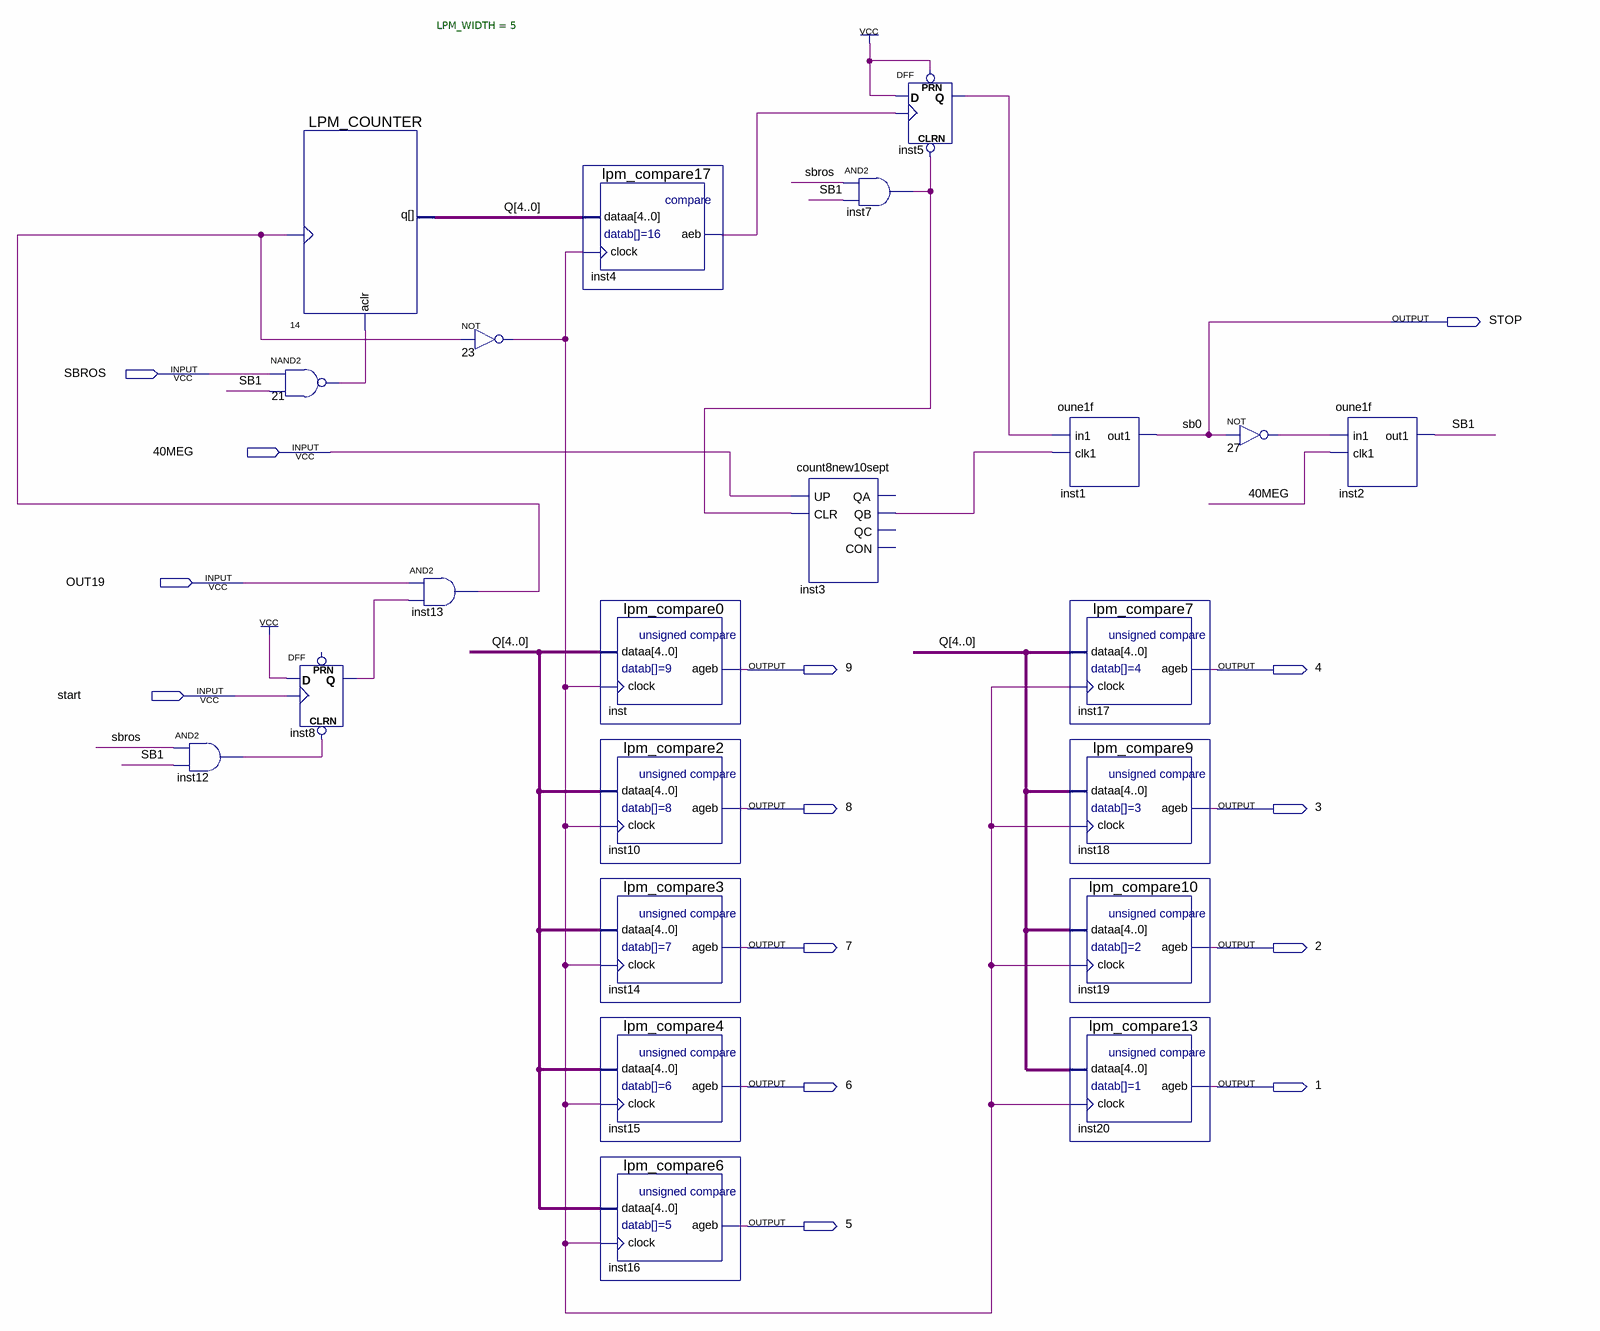
[diagram p0: schematic sheet]
// Quartus schematic count_N_6DES.bdf as structural Verilog: 22 symbols, 14 pins
module count_N_6DES (
  input  SBROS,
  input  \40MEG ,
  input  OUT19,
  input  start,
  output STOP,
  output \9 ,
  output \4 ,
  output \8 ,
  output \3 ,
  output \7 ,
  output \2 ,
  output \6 ,
  output \1 ,
  output \5 
);

  wire inst3_qb, inst4_aeb, inst5_q, inst7_out, inst8_q, inst12_out, inst13_out, n21_out, n23_out, n27_out,
       SB1;
  wire [4:0] Q;

  and inst12 (inst12_out, SBROS, SB1);
  LPM_COUNTER #(.LPM_WIDTH(5)) u_14 (.clock(inst13_out), .aclr(n21_out), .q(Q));
  nand u_21 (n21_out, SBROS, SB1);
  DFF inst8 (.CLRN(inst12_out), .CLK(start), .D(1'b1), .Q(inst8_q));  // open: PRN
  and inst13 (inst13_out, OUT19, inst8_q);
  not u_23 (n23_out, inst13_out);
  lpm_compare17 inst4 (.dataa(Q), .clock(n23_out), .aeb(inst4_aeb));
  lpm_compare0 inst (.dataa(Q), .clock(n23_out), .ageb(\9 ));
  lpm_compare2 inst10 (.dataa(Q), .clock(n23_out), .ageb(\8 ));
  lpm_compare3 inst14 (.dataa(Q), .clock(n23_out), .ageb(\7 ));
  lpm_compare4 inst15 (.dataa(Q), .clock(n23_out), .ageb(\6 ));
  lpm_compare6 inst16 (.dataa(Q), .clock(n23_out), .ageb(\5 ));
  count8new10sept inst3 (.UP(\40MEG ), .CLR(inst7_out), .QB(inst3_qb));  // open: QA, QC, CON
  and inst7 (inst7_out, SBROS, SB1);
  DFF inst5 (.CLRN(inst7_out), .CLK(inst4_aeb), .D(1'b1), .PRN(1'b1), .Q(inst5_q));
  oune1f inst1 (.in1(inst5_q), .clk1(inst3_qb), .out1(STOP));
  lpm_compare7 inst17 (.dataa(Q), .clock(n23_out), .ageb(\4 ));
  lpm_compare9 inst18 (.dataa(Q), .clock(n23_out), .ageb(\3 ));
  lpm_compare10 inst19 (.dataa(Q), .clock(n23_out), .ageb(\2 ));
  lpm_compare13 inst20 (.dataa(Q), .clock(n23_out), .ageb(\1 ));
  not u_27 (n27_out, STOP);
  oune1f inst2 (.in1(n27_out), .clk1(\40MEG ), .out1(SB1));

  // Other names for the same wires on the sheet: sb0 = STOP
endmodule
